# Altium schematic sheet [02] - BLOCK DIAGRAM.SchDoc
size Letter; CheckedBy: Pablo M.; DocumentNumber: 2; Revision: v1; SheetNumber: 2; SheetTotal: 5
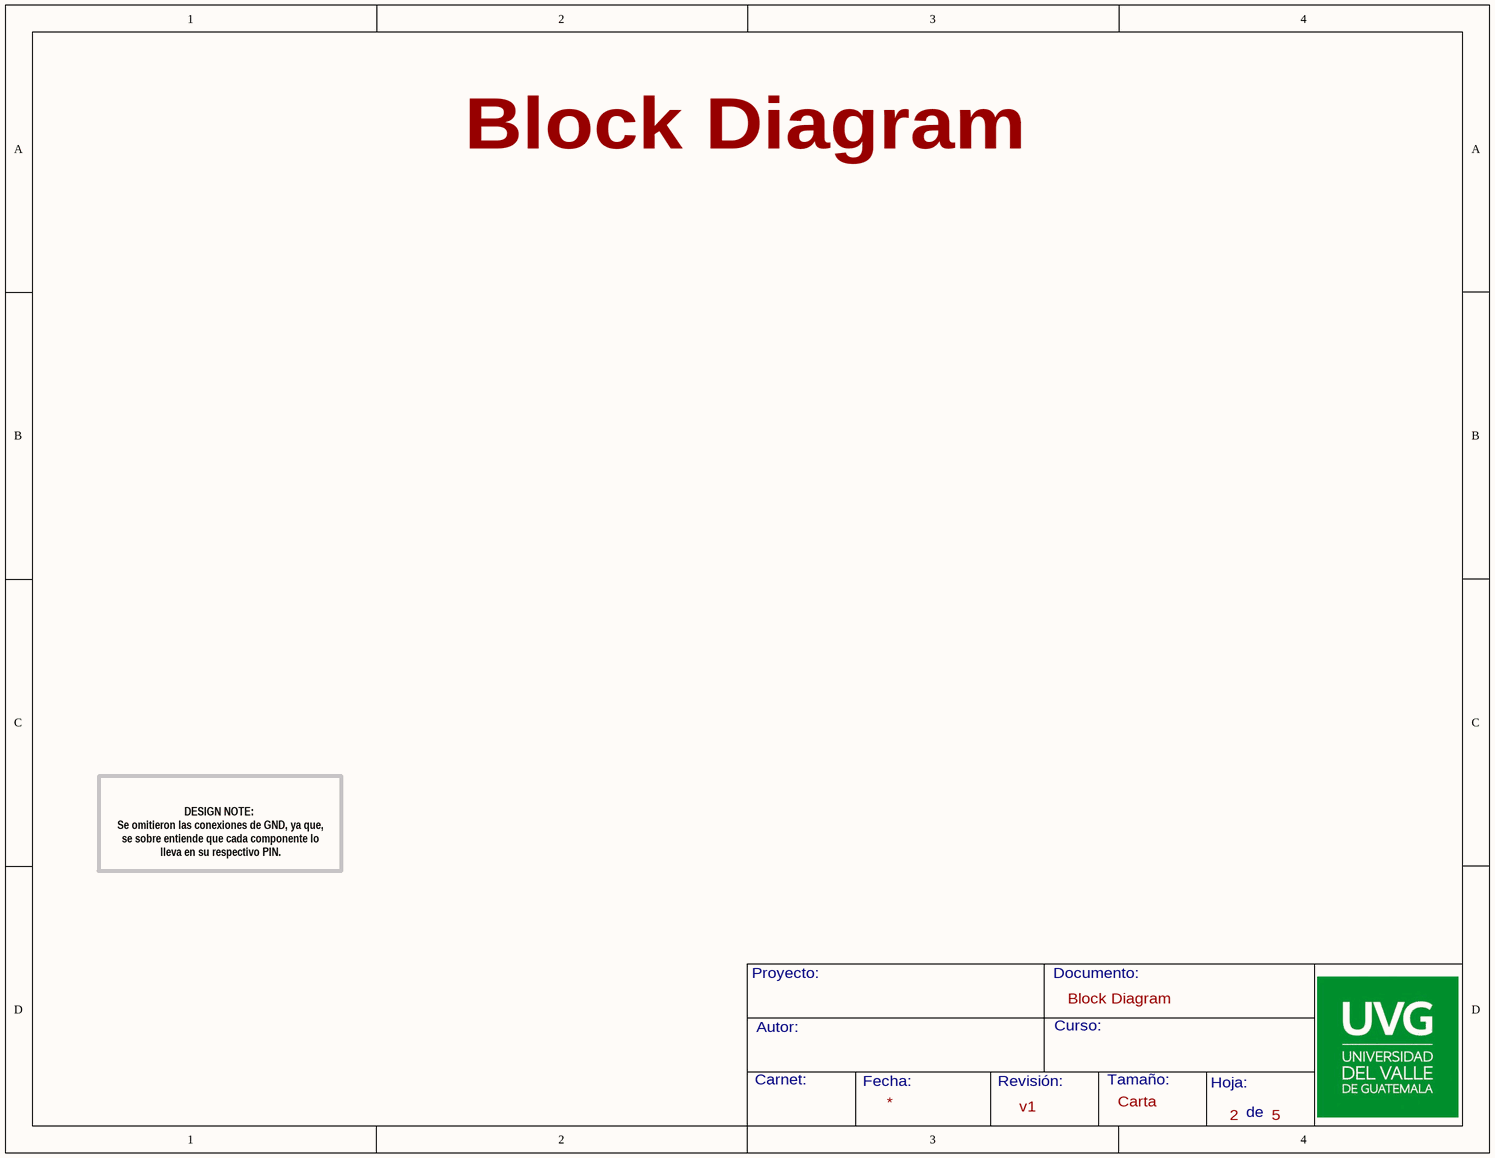
[diagram p0: [02] - BLOCK DIAGRAM.SchDoc]

## Notes on the sheet
- Block Diagram
- DESIGN NOTE:
  Se omitieron las conexiones de GND, ya que, se sobre entiende que cada componente lo lleva en su respectivo PIN.
- Proyecto:
- Documento:
- Autor:
- Curso:
- Carnet:
- Fecha:
- Revisión:
- Tamaño:
- Carta
- Hoja:
- de